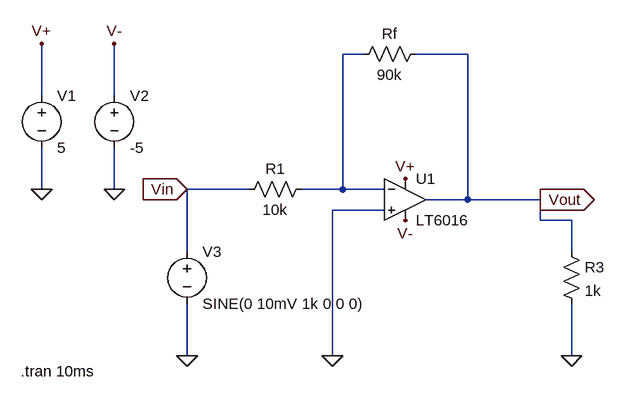
[diagram p0: schematic Task 3.asc]
Task 3.asc, the LTspice schematic file:
Version 4.1
SHEET 1 880 680
WIRE 496 64 464 64
WIRE 656 64 576 64
WIRE 0 128 0 48
WIRE 112 128 112 48
WIRE 0 272 0 208
WIRE 112 272 112 208
WIRE 320 272 224 272
WIRE 464 272 464 64
WIRE 464 272 400 272
WIRE 528 272 464 272
WIRE 656 288 656 64
WIRE 656 288 592 288
WIRE 768 288 656 288
WIRE 528 304 448 304
WIRE 768 320 768 288
WIRE 816 320 768 320
WIRE 224 368 224 272
WIRE 816 368 816 320
WIRE 224 528 224 448
WIRE 448 528 448 304
WIRE 816 528 816 448
FLAG 112 272 0
FLAG 0 272 0
FLAG 224 528 0
FLAG 448 528 0
FLAG 816 528 0
FLAG 560 256 V+
FLAG 560 320 V-
FLAG 0 48 V+
FLAG 112 48 V-
FLAG 224 272 Vin
IOPIN 224 272 In
FLAG 768 288 Vout
IOPIN 768 288 Out
SYMBOL voltage 0 112 R0
WINDOW 123 0 0 Left 0
WINDOW 39 0 0 Left 0
SYMATTR InstName V1
SYMATTR Value 5
SYMBOL voltage 112 112 R0
WINDOW 123 0 0 Left 0
WINDOW 39 0 0 Left 0
SYMATTR InstName V2
SYMATTR Value -5
SYMBOL OpAmps\\LT6016 560 288 R0
SYMATTR InstName U1
SYMBOL res 416 256 R90
WINDOW 0 0 56 VBottom 2
WINDOW 3 32 56 VTop 2
SYMATTR InstName R1
SYMATTR Value 10k
SYMBOL res 592 48 R90
WINDOW 0 0 56 VBottom 2
WINDOW 3 32 56 VTop 2
SYMATTR InstName Rf
SYMATTR Value 90k
SYMBOL res 800 352 R0
SYMATTR InstName R3
SYMATTR Value 1k
SYMBOL voltage 224 352 R0
WINDOW 123 0 0 Left 0
WINDOW 39 0 0 Left 0
SYMATTR InstName V3
SYMATTR Value SINE(0 10mV 1k 0 0 0)
TEXT -32 552 Left 2 !.tran 10ms

The netlist it stands for:
* Task 3.asc
V1 V+ 0 5
V2 V- 0 -5
* U1: LT6016 (symbol OpAmps\LT6016 not available, pins judged from their places): In+=0 In-=N001 V+=V+ V-=V- OUT=Vout
R1 N001 Vin 10k
Rf Vout N001 90k
R3 Vout 0 1k
V3 Vin 0 SINE(0 10mV 1k 0 0 0)
.tran 10ms
.backanno
.end